# Altium schematic sheet Relay_Control_Outputs.SchDoc
size A4; SheetNumber: 9; SheetTotal: 13
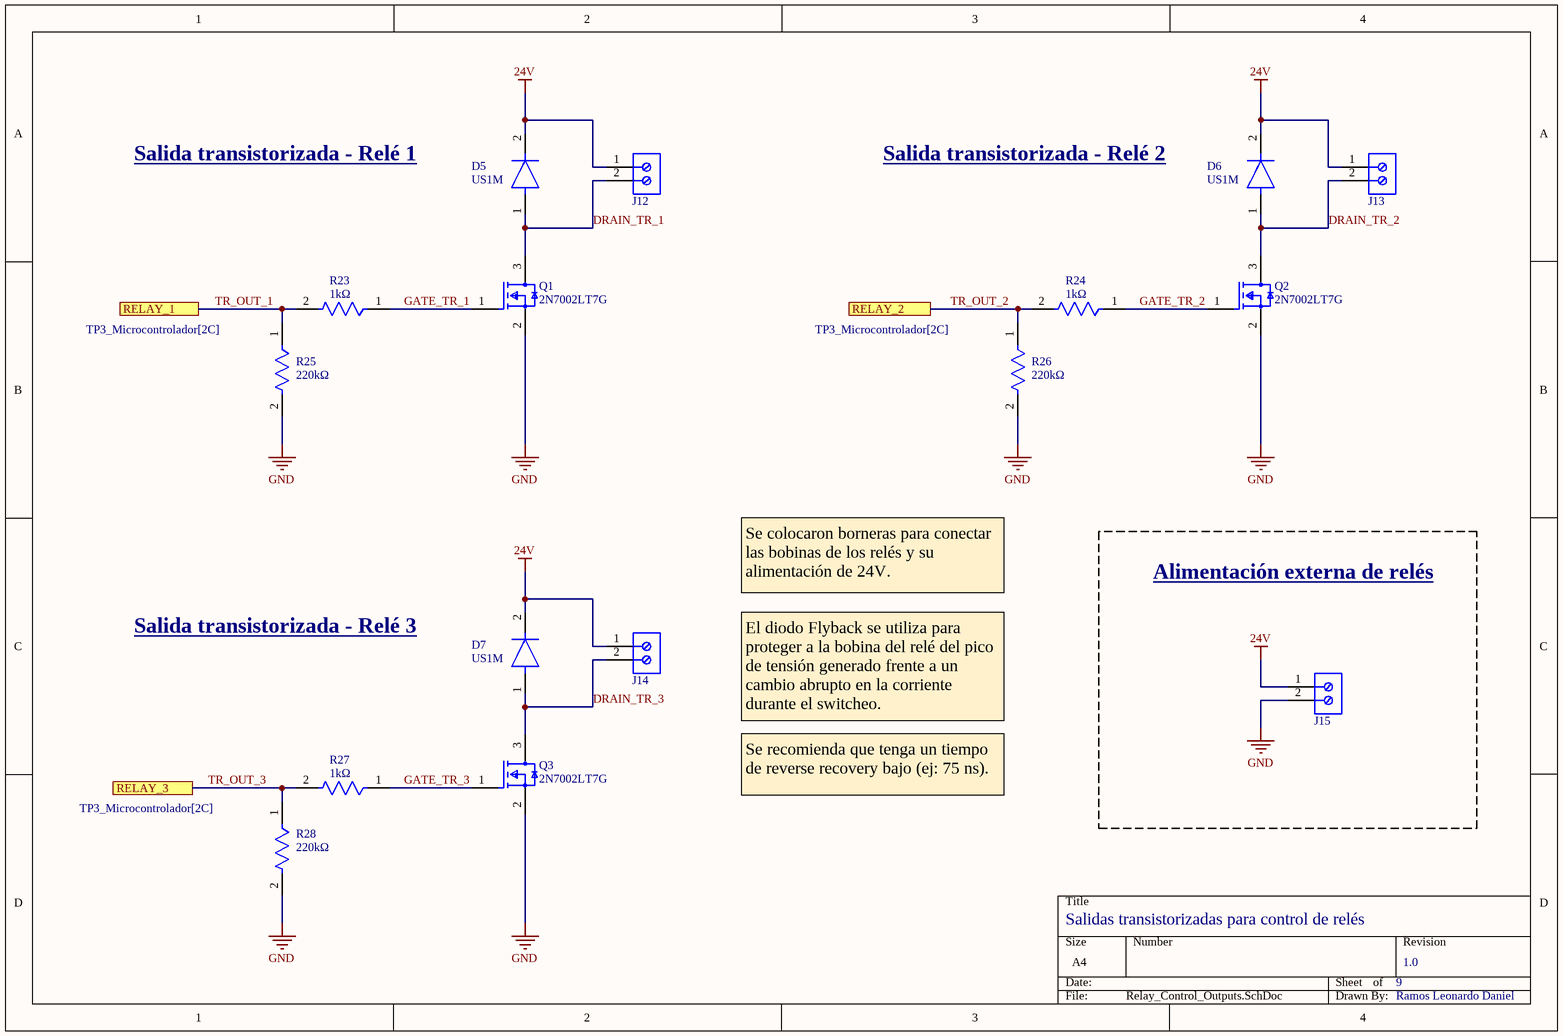
[diagram p0: Relay_Control_Outputs.SchDoc]

## Parts
D5  US1M  [SMA_DO-214AC]
D6  US1M  [SMA_DO-214AC]
D7  US1M  [SMA_DO-214AC]
J12  691137710002  [691137710002]  (value not drawn)
J13  691137710002  [691137710002]  (value not drawn)
J14  691137710002  [691137710002]  (value not drawn)
J15  691137710002  [691137710002]  (value not drawn)
Q1  2N7002LT7G  [FP-318-MFG]
Q2  2N7002LT7G  [FP-318-MFG]
Q3  2N7002LT7G  [FP-318-MFG]
R23  Resistance: 1kΩ  [FP-CRCW0805-e3-IPC_B]  (hidden comment: CRCW08054K70JNEA)
R24  Resistance: 1kΩ  [FP-CRCW0805-e3-IPC_B]  (hidden comment: CRCW08054K70JNEA)
R25  Resistance: 220kΩ  [FP-CRCW0805-e3-IPC_B]  (hidden comment: CRCW08054K70JNEA)
R26  Resistance: 220kΩ  [FP-CRCW0805-e3-IPC_B]  (hidden comment: CRCW08054K70JNEA)
R27  Resistance: 1kΩ  [FP-CRCW0805-e3-IPC_B]  (hidden comment: CRCW08054K70JNEA)
R28  Resistance: 220kΩ  [FP-CRCW0805-e3-IPC_B]  (hidden comment: CRCW08054K70JNEA)

## Blocks framed on the sheet
Alimentación externa de relés: J15

## Ports
RELAY_1 (see TP3_Microcontrolador[2C]), RELAY_2 (see TP3_Microcontrolador[2C]), RELAY_3 (see TP3_Microcontrolador[2C])

## Nets
24V: D5.2(K) D6.2(K) D7.2(K) J12.1 J13.1 J14.1 J15.1
GND: J15.2 Q1.2(Source) Q2.2(Source) Q3.2(Source) R25.2 R26.2 R28.2
DRAIN_TR_1: D5.1(A) J12.2 Q1.3(Drain)
DRAIN_TR_2: D6.1(A) J13.2 Q2.3(Drain)
DRAIN_TR_3: D7.1(A) J14.2 Q3.3(Drain)
GATE_TR_1: Q1.1(Gate) R23.1
GATE_TR_2: Q2.1(Gate) R24.1
GATE_TR_3: Q3.1(Gate) R27.1
TR_OUT_1: R23.2 R25.1 ; port RELAY_1
TR_OUT_2: R24.2 R26.1 ; port RELAY_2
TR_OUT_3: R27.2 R28.1 ; port RELAY_3

## Notes on the sheet
- (near D5) Salida transistorizada - Relé 1
- (near D6) Salida transistorizada - Relé 2
- (near D7) Salida transistorizada - Relé 3
- Se colocaron borneras para conectar las bobinas de los relés y su alimentación de 24V.
- El diodo Flyback se utiliza para proteger a la bobina del relé del pico de tensión generado frente a un cambio abrupto en la corriente durante el switcheo.
- Se recomienda que tenga un tiempo de reverse recovery bajo (ej: 75 ns).
- Salidas transistorizadas para control de relés
- 9
- 1.0
- Ramos Leonardo Daniel

## Library data of the parts
D5-D7 = Diode: Simbolo genérico de diodo.
J12-J15 = CMP-1502-03324-2: NexarPartId: 78871135; Voltage Rating: 300V; Number of Contacts: 2; Current Rating: 16A; Lead Pitch: 5mm; Height: 11.6mm; Packaging: Box; RoHS: Non-Compliant; Contact Material: Nickel, Tin; Max Operating Temperature: 120°C; Number of Pins: 2; Min Operating Temperature: -30°C; Number of Rows: 1
Q1-Q3 = CMP-00278-97862277-1: 2N7002LT7G SOT23, N-Channel MOSFET - 60V 115MA 7.5Ohm SOT23, N-Ch Mosfet - 60V 115MA 7.5O; Manufacturer Lifecycle Status: ACTIVE; RoHS: Compliant; NexarPartId: 97862277; Schedule B: 8541210080, 8541210080; Lifecycle Status: Production
R23 R24 R27 = CMP-2001-03967-2: RES Thick Film, 1kΩ, 5%, 0.125W, 200ppm/°C, 0805; Power Rating: 125mW; Voltage Rating: 150V; Radiation Hardening: No; Case Code (Imperial): 0805; Military Standard: Not; Contact Plating: Tin; Weight: 0.000194oz; Mount: Surface Mount; Termination: SMD/SMT; Packaging: Tape and Reel; Min Operating Temperature: -55°C; Width: 1.25mm; Tolerance: 5%; Height: 0.45mm; Depth: 1.25mm; Length: 2mm; Temperature Coefficient: 200ppm/°C; Case Code (Metric): 2012; Package Quantity: 5000; Max Operating Temperature: 155°C; Case/Package: 0805; Composition: Thick Film
R25 R26 R28 = CMP-2001-03967-2: RES Thick Film, 10kΩ, 5%, 0.125W, 200ppm/°C, 0805; Power Rating: 125mW; Voltage Rating: 150V; Radiation Hardening: No; Case Code (Imperial): 0805; Military Standard: Not; Contact Plating: Tin; Weight: 0.000194oz; Mount: Surface Mount; Termination: SMD/SMT; Packaging: Tape and Reel; Min Operating Temperature: -55°C; Width: 1.25mm; Tolerance: 5%; Height: 0.45mm; Depth: 1.25mm; Length: 2mm; Temperature Coefficient: 200ppm/°C; Case Code (Metric): 2012; Package Quantity: 5000; Max Operating Temperature: 155°C; Case/Package: 0805; Composition: Thick Film